# Altium project MB_SAUVC26.PrjPcb
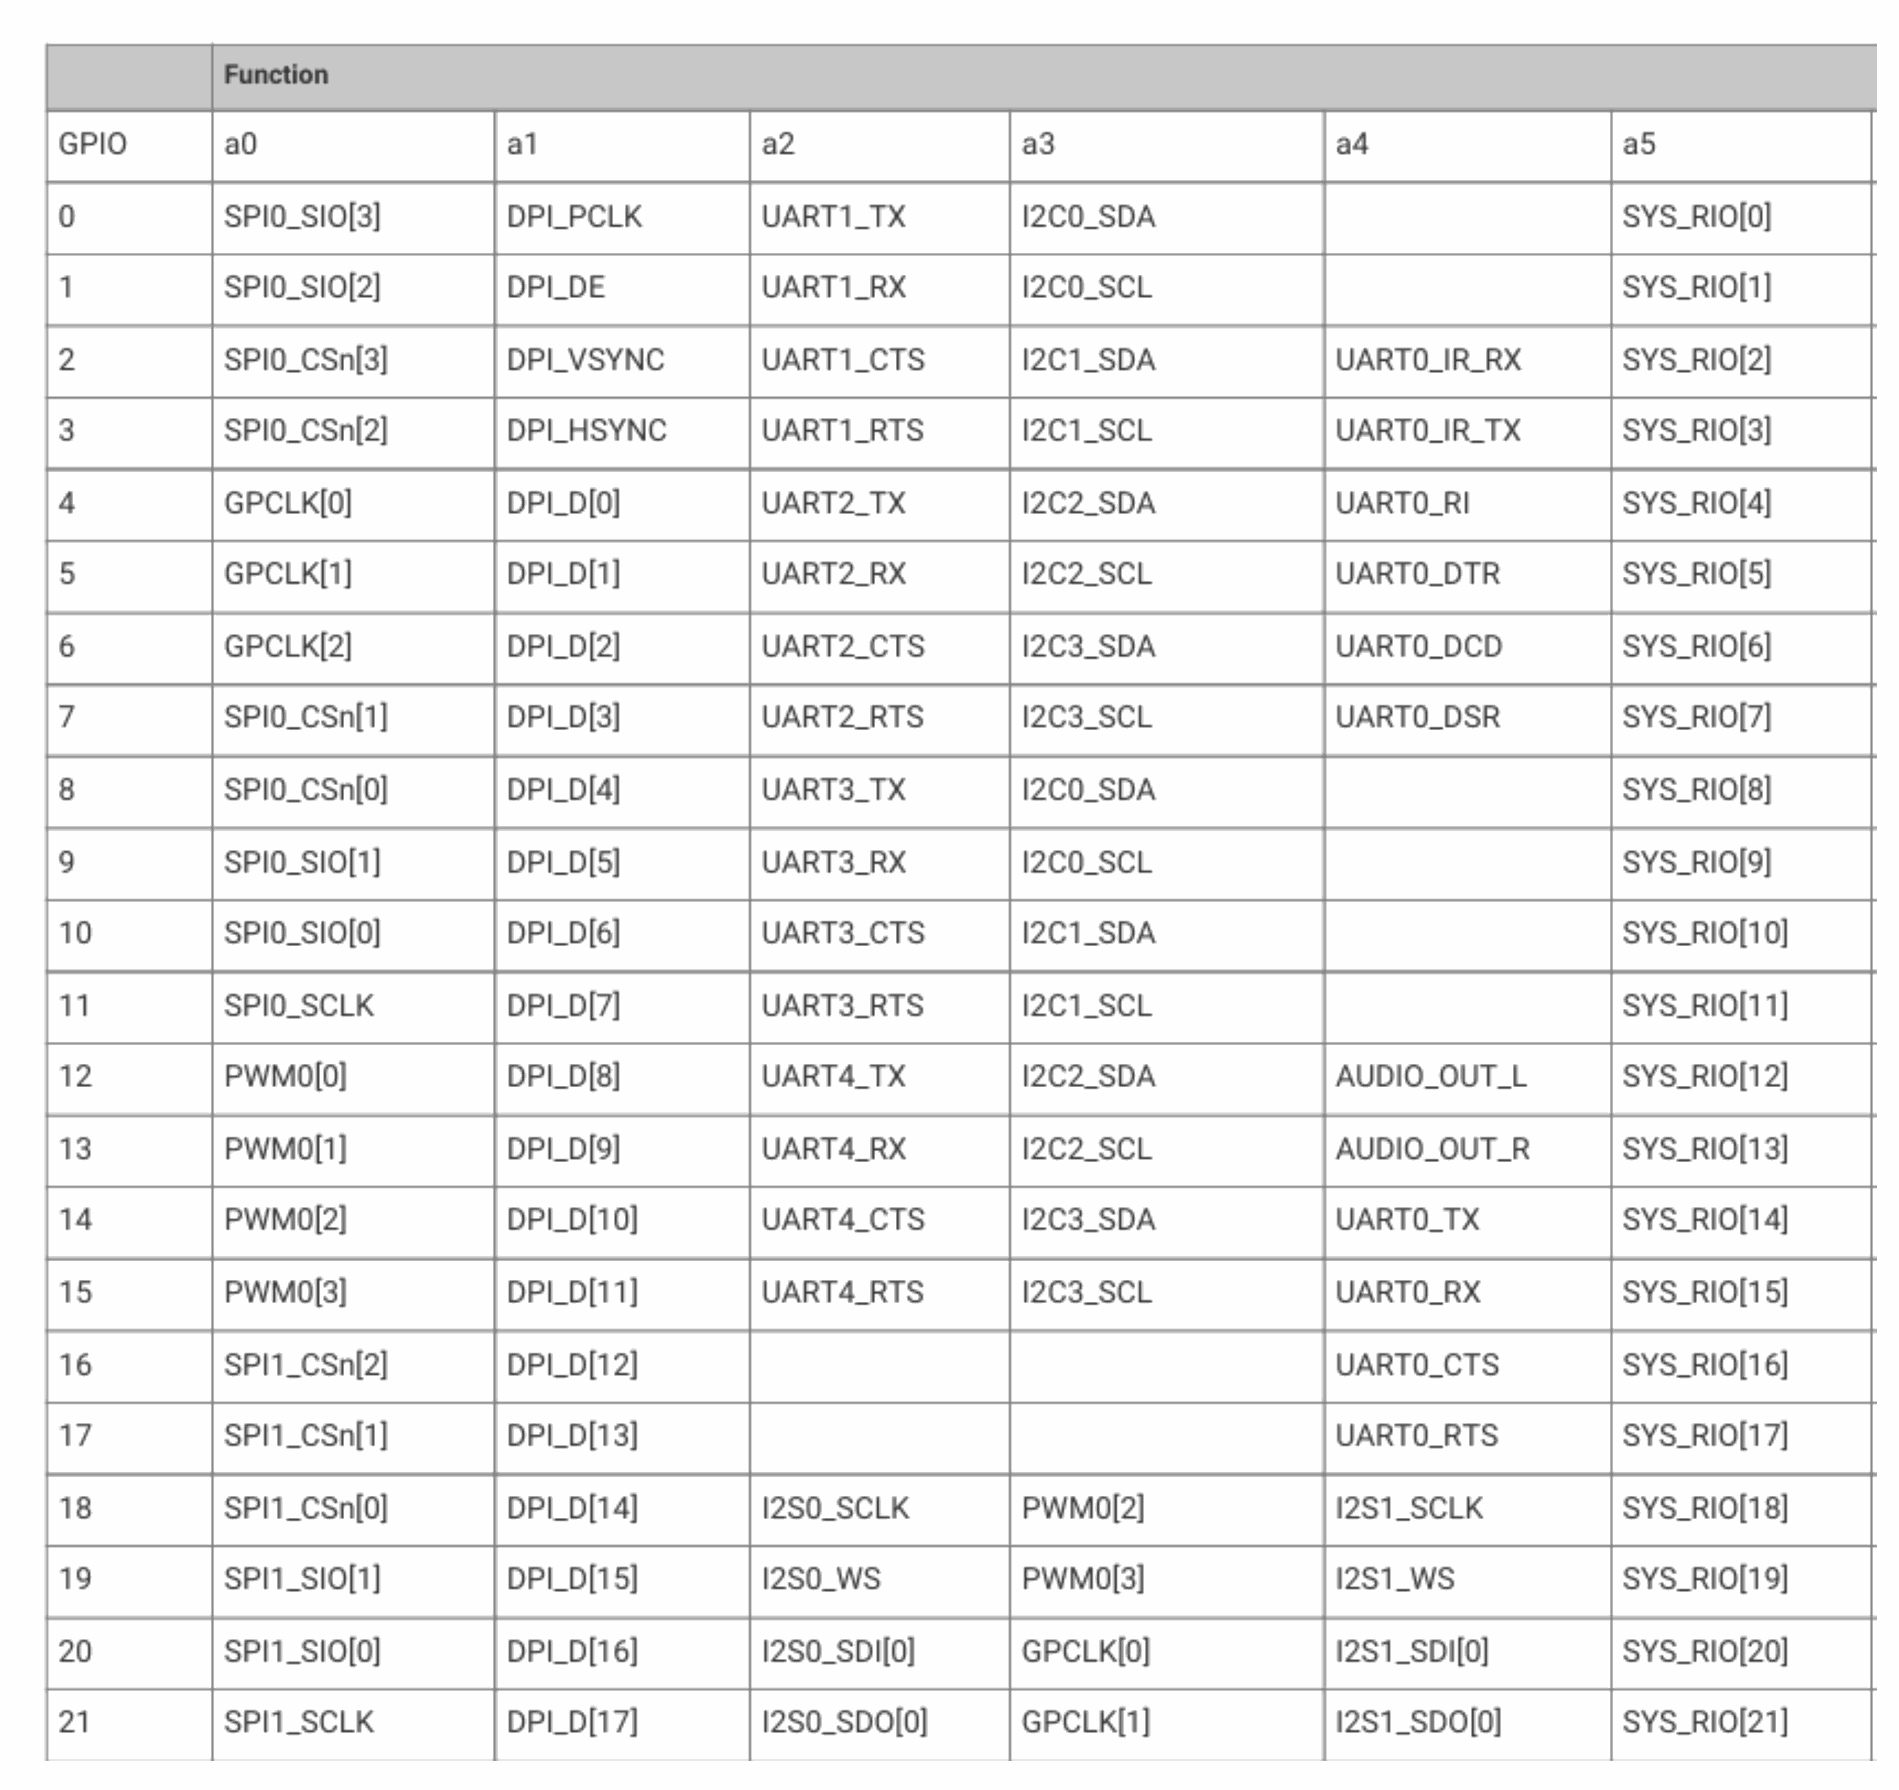
[diagram p0: Sheet1.SchDoc, left]
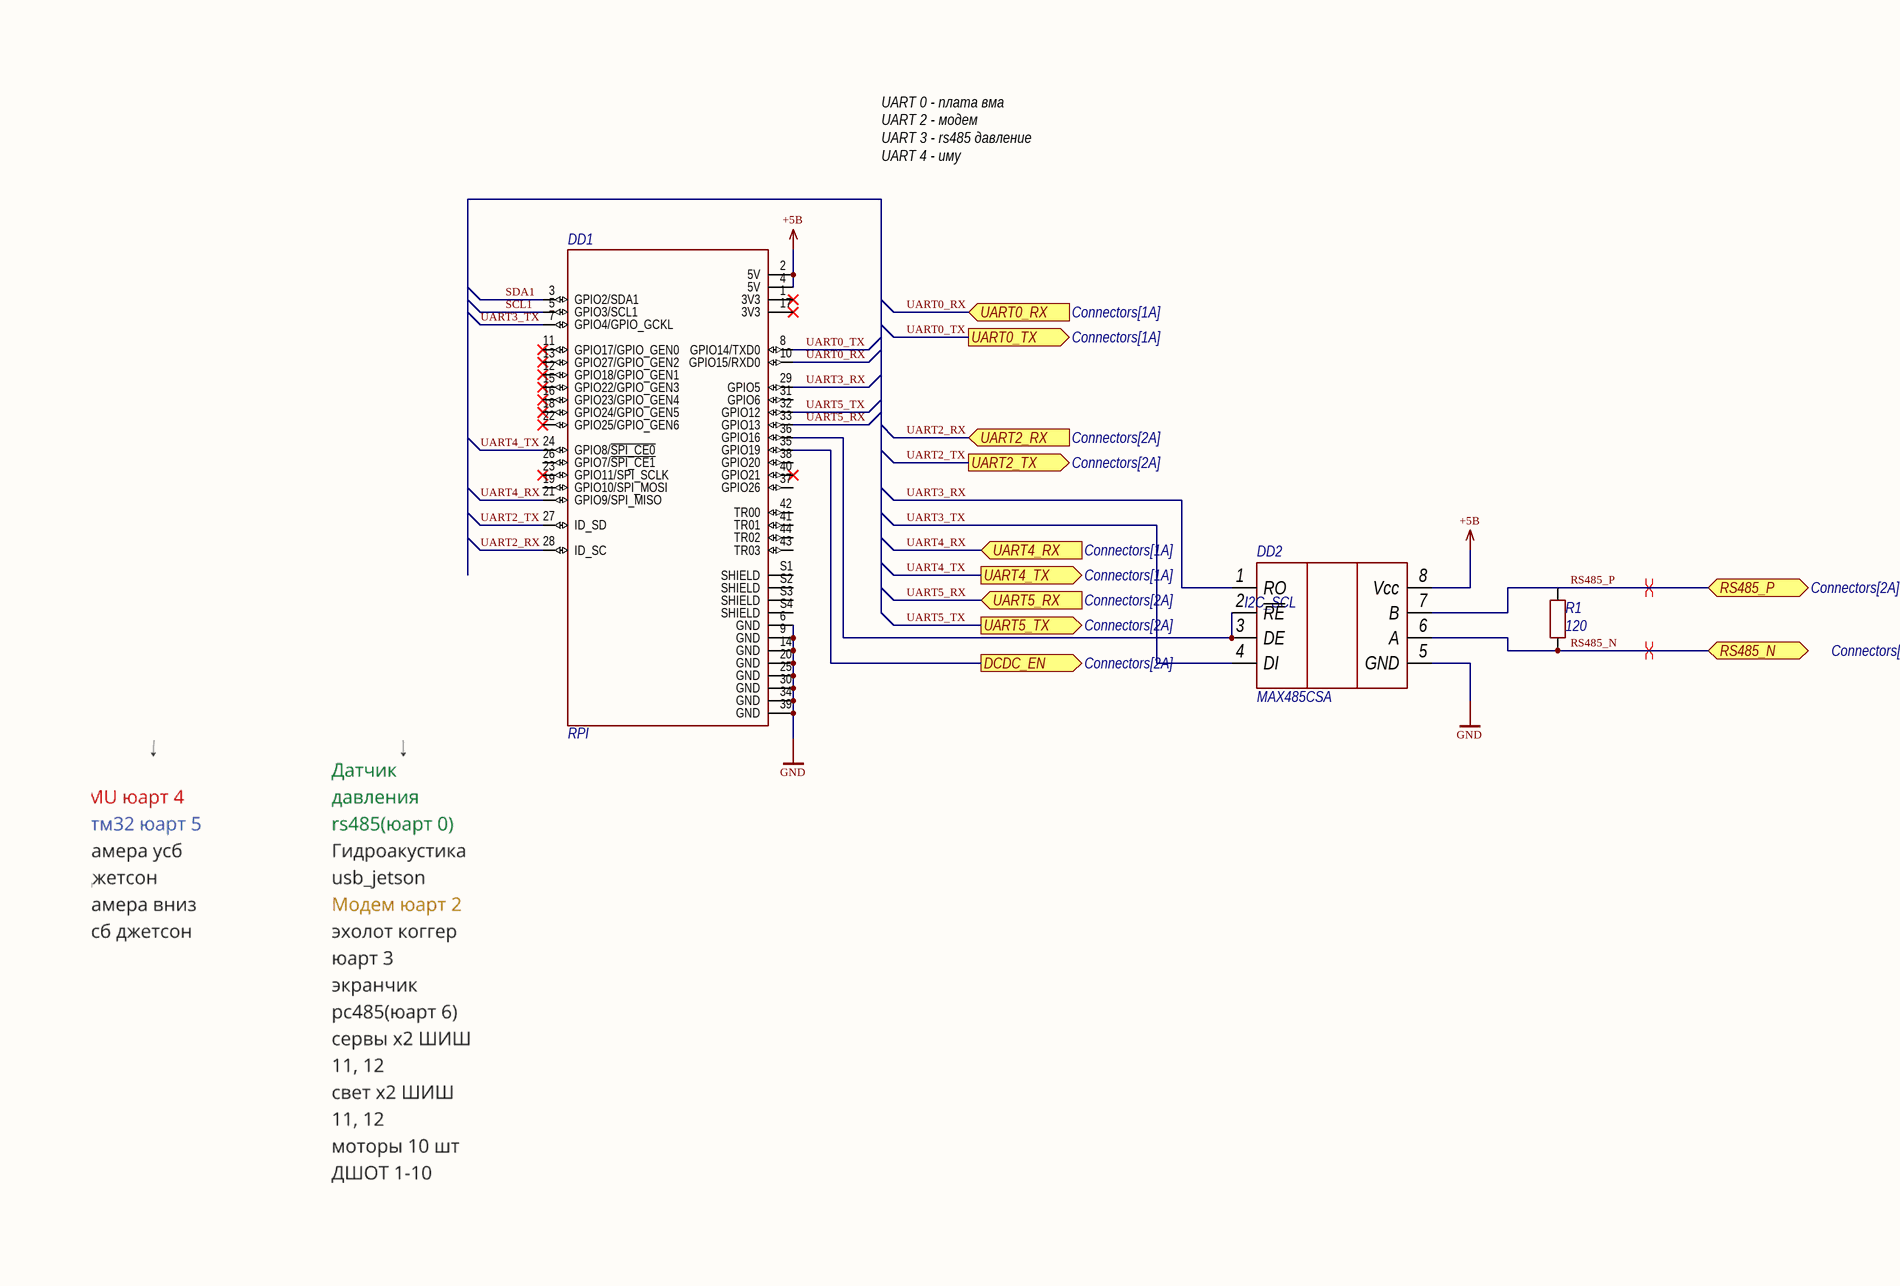
[diagram p1: Sheet1.SchDoc, right]
Version: 03; Title: Материнская плата аппарата НеоВельт; Release_Date: 29.07.2025; DrawnBy: Булатов и ко; Decimal_Number_Shematic: ГИДР.123456.011; Decimal_Number_PCB: ГИДР.123456.010
4 sheets, 72 parts. Net scope: global (net labels, ports and power ports of the same name join across sheets).
Board file: 4 layers.PcbDoc
Sheets:
  Sheet1.SchDoc
  DCDC_Jetson.SchDoc
  Connectors.SchDoc
  DCDC_RPI.SchDoc

## Sheet Sheet1.SchDoc: Материнская плата аппарата НеоВельт
size 420 x 297 mm; PageSetup: Record=PageOptions|CenterHorizontal=True|CenterVertical=True|PrintScale=0.94|XCorrection=1.00|YCorrection=1.00|PrintKind=1|BorderSize=5000000|LeftOffset=0|BottomOffset=0|Orientation=1|PaperLength=1000|PaperWidth=1000|Scale=100|PaperSource=7|PrintQuality=-4|MediaType=1|DitherType=10|PaperKind=A4|PrintScaleMode=1; Address1: Address1; Address2: Address2; Address3: Address3; Address4: Address4; DocumentNumber: 1; SheetNumber: 1; SheetTotal: 4

### Parts
DD1  RPI  [RPI]
DD2  MAX485CSA  [SOIC-8]
R1  value 120  [0603R]  (hidden comment: Resistor)

### Ports
DCDC_EN (out, see Connectors[2A]), RS485_N (bidir, see Connectors[2A]), RS485_P (bidir, see Connectors[2A]), UART0_RX (in, see Connectors[1A]), UART0_TX (out, see Connectors[1A]), UART2_RX (in, see Connectors[2A]), UART2_TX (out, see Connectors[2A]), UART4_RX (in, see Connectors[1A]), UART4_TX (out, see Connectors[1A]), UART5_RX (in, see Connectors[2A]), UART5_TX (out, see Connectors[2A])

### Nets
+5В: DD1.2(5V) DD1.4(5V) DD2.8(Vcc)
GND: DD1.6(GND) DD1.9(GND) DD1.14(GND) DD1.20(GND) DD1.25(GND) DD1.30(GND) DD1.34(GND) DD1.39(GND) DD2.5(GND)
DCDC_EN: DD1.35(GPIO19) ; port DCDC_EN
RS485_N: DD2.6(A) R1.1 ; port RS485_N
RS485_P: DD2.7(B) R1.2 ; port RS485_P
SCL1: DD1.5(GPIO3/SCL1)
SDA1: DD1.3(GPIO2/SDA1)
UART0_RX: DD1.10(GPIO15/RXD0) ; port UART0_RX
UART0_TX: DD1.8(GPIO14/TXD0) ; port UART0_TX
UART2_RX: DD1.28(ID_SC) ; port UART2_RX
UART2_TX: DD1.27(ID_SD) ; port UART2_TX
UART3_RX: DD1.29(GPIO5) DD2.1(RO)
UART3_TX: DD1.7(GPIO4/GPIO_GCKL) DD2.4(DI)
UART4_RX: DD1.21(GPIO9/SPI_MISO) ; port UART4_RX
UART4_TX: DD1.24(GPIO8/~{SPI_CE0}) ; port UART4_TX
UART5_RX: DD1.33(GPIO13) ; port UART5_RX
UART5_TX: DD1.32(GPIO12) ; port UART5_TX
NetDD1_36: DD1.36(GPIO16) DD2.2(~{RE}) DD2.3(DE)

Not connected (* = marked no-connect by the designer): DD1 1(3V3)* 11(GPIO17/GPIO_GEN0)* 12(GPIO18/GPIO_GEN1)* 13(GPIO27/GPIO_GEN2)* 15(GPIO22/GPIO_GEN3)* 16(GPIO23/GPIO_GEN4)* 17(3V3)* 18(GPIO24/GPIO_GEN5)* 19(GPIO10/SPI_MOSI) 22(GPIO25/GPIO_GEN6)* 23(GPIO11/SPI_SCLK)* 26(GPIO7/~{SPI_CE1}) 31(GPIO6) 37(GPIO26) 38(GPIO20) 40(GPIO21)* 41(TR01) 42(TR00) 43(TR03) 44(TR02) S1(SHIELD) S2(SHIELD) S3(SHIELD) S4(SHIELD)

### Layout directives
differential pair: RS485_N, RS485_P

### Notes on the sheet
- UART 0 - плата вма
  UART 2 - модем
  UART 3 - rs485 давление
  UART 4 - иму
- (near DD2) I2C_SCL
- Перв. примен.
- Справ. №
- Подп. и дата
- Инв. № дубл.
- Взам. инв. №
- Разраб.
- Изм.
- Лист
- № докум.
- Подп.
- Дата
- Лит.
- Масса
- Масштаб
- Пров.
- Т.контр.
- Схема электрическая принципиальная
- Листов
- Инв. № подл.
- Утв.
- Н.контр.
- Копировал
- Формат А3

### Library data of the parts
DD1 = RPI: Одноплатный компьютер Raspberry PI 4B; Part Number: RPI
DD2 = MAX485CSA: RS-485 приёмопередатчик; Part Number: MAX485CSA
R1 = Resistor_120_1_0603: Резистор номиналом 120 Ом и точностью 1%; Power: *; Part Number: Resistor_120_1_0603; Tolerance: 1%

## Sheet DCDC_Jetson.SchDoc: Материнская плата аппарата НеоВельт
size 420 x 297 mm; Address1: Address1; Address2: Address2; Address3: Address3; Address4: Address4; DocumentNumber: 4; SheetNumber: 2; SheetTotal: 4
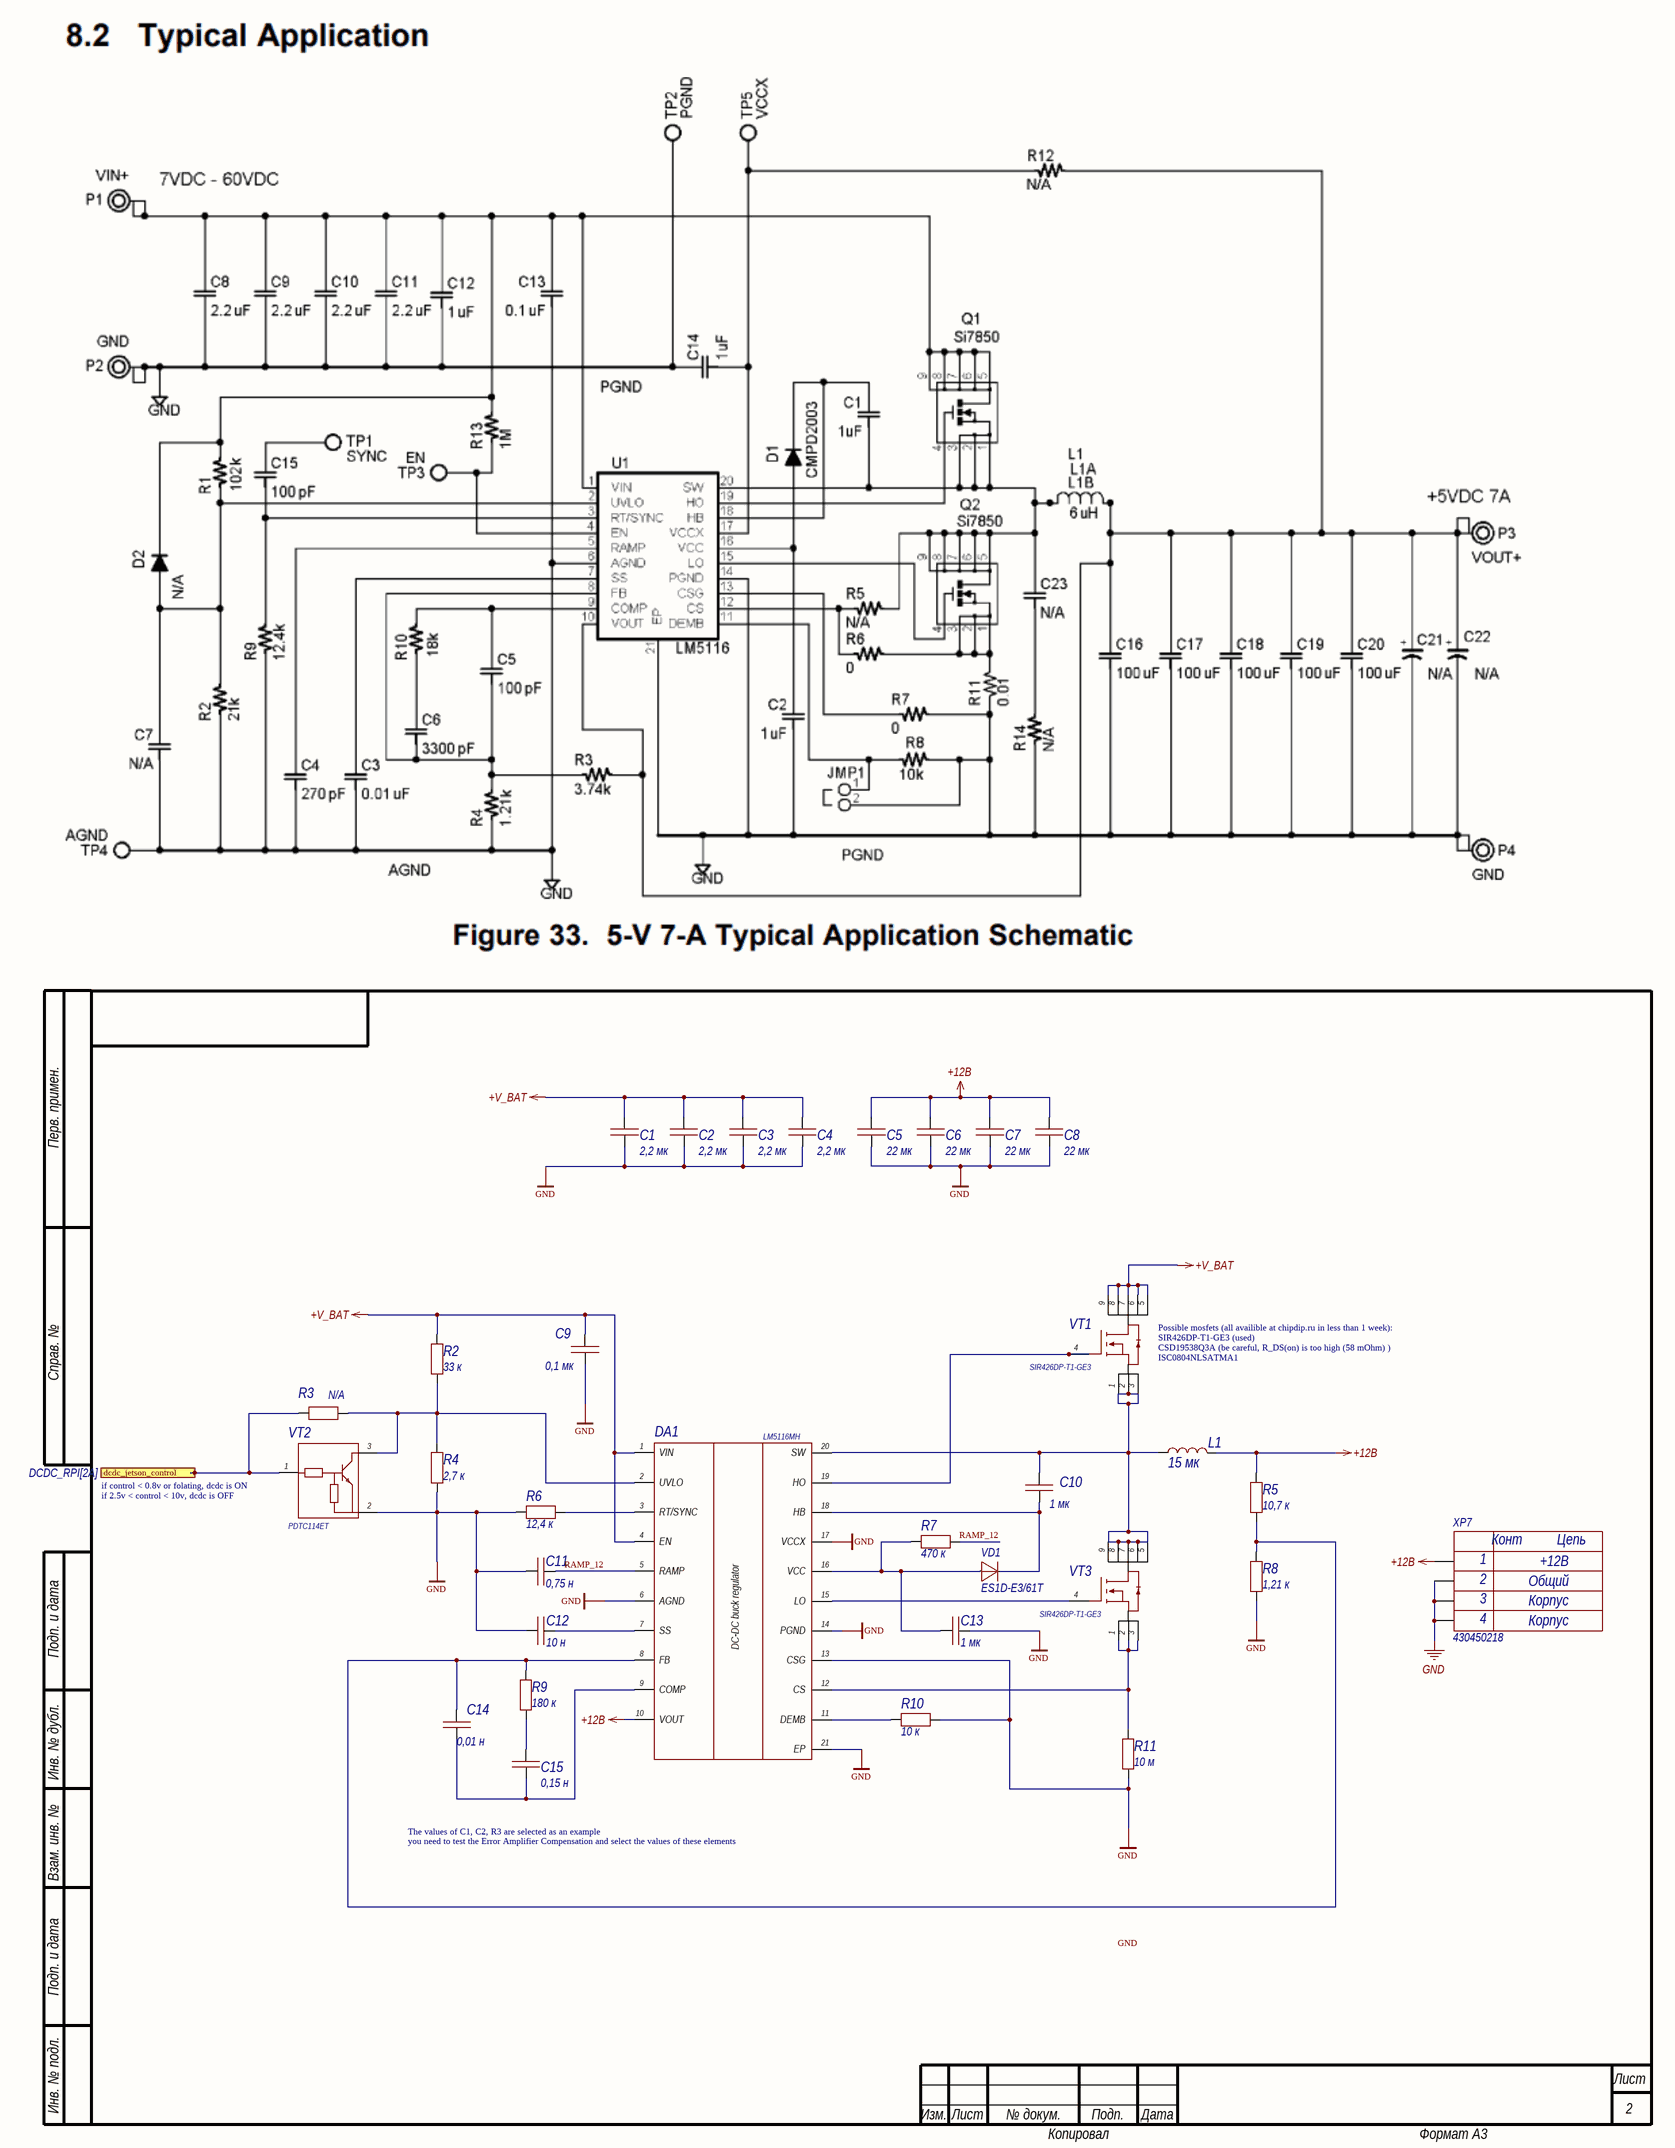
[diagram p2: DCDC_Jetson.SchDoc]

### Parts
C1  value 2,2 мк  [1206C]  (hidden comment: Capacitor)
C2  value 2,2 мк  [1206C]  (hidden comment: Capacitor)
C3  value 2,2 мк  [1206C]  (hidden comment: Capacitor)
C4  value 2,2 мк  [1206C]  (hidden comment: Capacitor)
C5  value 22 мк  [1210C]  (hidden comment: Capacitor)
C6  value 22 мк  [1210C]  (hidden comment: Capacitor)
C7  value 22 мк  [1210C]  (hidden comment: Capacitor)
C8  value 22 мк  [1210C]  (hidden comment: Capacitor)
C9  value 0,1 мк  [0603C]  (hidden comment: Capacitor)
C10  value 1 мк  [0603C]  (hidden comment: Capacitor)
C11  value 0,75 н  [0603C]  (hidden comment: Capacitor)
C12  value 10 н  [0603C]  (hidden comment: Capacitor)
C13  value 1 мк  [0603C]  (hidden comment: Capacitor)
C14  value 0,01 н  [0603C]  (hidden comment: Capacitor)
C15  value 0,15 н  [0603C]  (hidden comment: Capacitor)
DA1  LM5116MH  [HTSSOP-20]
L1  value 15 мк  [SPRH127]  (hidden comment: CDSPRH127-150M)
R2  value 33 к  [0603R]  (hidden comment: Resistor)
R3  Resistor  [0603R]  (value not drawn)
R4  value 2,7 к  [0603R]  (hidden comment: Resistor)
R5  value 10,7 к  [0603R]  (hidden comment: Resistor)
R6  value 12,4 к  [0603R]  (hidden comment: Resistor)
R7  value 470 к  [0603R]  (hidden comment: Resistor)
R8  value 1,21 к  [0603R]  (hidden comment: Resistor)
R9  value 180 к  [0603R]  (hidden comment: Resistor)
R10  value 10 к  [0603R]  (hidden comment: Resistor)
R11  value 10 м  [1210R]  (hidden comment: Resistor)
VD1  ES1D-E3/61T  [SMA]
VT1  SIR426DP-T1-GE3  [PowerPAK_SO-8]
VT2  PDTC114ET  [SOT23-3]
VT3  SIR426DP-T1-GE3  [PowerPAK_SO-8]
XP7  430450218  Value3: Корпус  Value2: Общий  Value1: +12В  [Molex_430450218]

### Ports
dcdc_jetson_control (in, see DCDC_RPI[2A])

### Nets
+12В: C5.2 C6.2 C7.2 C8.2 DA1.10(VOUT) L1.2 R5.2 XP7.1
+V_BAT: C1.2 C2.2 C3.2 C4.2 C9.2 DA1.1(VIN) DA1.4(EN) R2.2 VT1.5 VT1.6 VT1.7 VT1.8 VT1.9
GND: C1.1 C2.1 C3.1 C4.1 C5.1 C6.1 C7.1 C8.1 C9.1 C11.1 C12.1 C13.2 DA1.6(AGND) DA1.13(CSG) DA1.14(PGND) DA1.17(VCCX) DA1.21(EP) R4.1 R6.1 R8.1 R10.2 R11.1 VT2.2(E) XP7.0 XP7.2
RAMP_12: C11.2 DA1.5(RAMP) R7.2
NetC10_1: C10.1 DA1.18(HB) VD1.2
NetC10_2: C10.2 DA1.20(SW) L1.1 VT1.1 VT1.2 VT1.3 VT3.5 VT3.6 VT3.7 VT3.8 VT3.9
NetC12_2: C12.2 DA1.7(SS)
NetC13_1: C13.1 DA1.16(VCC) R7.1 VD1.1
NetC14_1: C14.1 C15.1 DA1.9(COMP)
NetC14_2: C14.2 DA1.8(FB) R5.1 R8.2 R9.2
NetC15_2: C15.2 R9.1
NetDA1_2: DA1.2(UVLO) R2.1 R3.2 R4.2 VT2.3(C)
NetDA1_3: DA1.3(RT/SYNC) R6.2
NetDA1_11: DA1.11(DEMB) R10.1
NetDA1_12: DA1.12(CS) R11.2 VT3.1 VT3.2 VT3.3
NetDA1_15: DA1.15(LO) VT3.4
NetDA1_19: DA1.19(HO) VT1.4
NetR3_1: R3.1 VT2.1(B) ; port dcdc_jetson_control

### Notes on the sheet
- (near VT1) Possible mosfets (all availible at chipdip.ru in less than 1 week):
- (near VT1) CSD19538Q3A (be careful, R_DS(on) is too high (58 mOhm) )
- (near VT1) SIR426DP-T1-GE3 (used)
- (near VT1) ISC0804NLSATMA1
- (near VT2) if 2.5v < control < 10v, dcdc is OFF
- (near VT2) if control < 0.8v or folating, dcdc is ON
- The values of C1, C2, R3 are selected as an example
- you need to test the Error Amplifier Compensation and select the values of these elements
- Labels drawn without touching a wire or pin: GND
- Перв. примен.
- Справ. №
- Подп. и дата
- Инв. № дубл.
- Взам. инв. №
- Инв. № подл.
- Изм.
- Лист
- № докум.
- Подп.
- Дата
- Копировал
- Формат А3
- (in symbol LM5116MH) DC-DC buck regulator
- (in symbol Molex_430450218) Конт; Цепь; 3; 4

### Library data of the parts
C1-C4 = Capacitor_2,2u_10_50V_X7R_1206C: Конденсатор; Library Path2: Schematic\Capacitor.SchLib; Tolerance: 0,1; Voltage (V): 50; Dielectric: X7R; Capacity (nF): 2200; Part Number: Capacitor_2,2u_10_50V_X7R_1206C
C5-C8 = Capacitor_22u_10_25V_X7R_1210C: Конденсатор; Library Path2: Schematic\Capacitor.SchLib; Tolerance: 0,1; Voltage (V): 25; Dielectric: X7R; Capacity (nF): 22000; Part Number: Capacitor_22u_10_25V_X7R_1210C
C9 = Capacitor_0,1u_10_50V_X7R_0603C: Конденсатор; Library Path2: Schematic\Capacitor.SchLib; Tolerance: 0,1; Voltage (V): 50; Dielectric: X7R; Capacity (nF): 100; Part Number: Capacitor_0,1u_10_50V_X7R_0603C
C10 C13 = Capacitor_1u_10_50V_X7R_0603C: Конденсатор; Library Path2: Schematic\Capacitor.SchLib; Tolerance: 0,1; Voltage (V): 50; Dielectric: X7R; Capacity (nF): 1000; Part Number: Capacitor_1u_10_50V_X7R_0603C
C11 = Capacitor_0,75n_10_50V_X7R_0603C: Конденсатор; Library Path2: Schematic\Capacitor.SchLib; Tolerance: 0,1; Voltage (V): 50; Dielectric: X7R; Capacity (nF): 0,75; Part Number: Capacitor_0,75n_10_50V_X7R_0603C
C12 = Capacitor_10n_10_50V_X7R_0603C: Конденсатор; Library Path2: Schematic\Capacitor.SchLib; Tolerance: 0,1; Voltage (V): 50; Dielectric: X7R; Capacity (nF): 10; Part Number: Capacitor_10n_10_50V_X7R_0603C
C14 = Capacitor_0,01n_10_50V_X7R_0603C: Конденсатор; Library Path2: Schematic\Capacitor.SchLib; Tolerance: 0,1; Voltage (V): 50; Dielectric: X7R; Capacity (nF): 0,01; Part Number: Capacitor_0,01n_10_50V_X7R_0603C
C15 = Capacitor_0,15n_10_50V_X7R_0603C: Конденсатор; Library Path2: Schematic\Capacitor.SchLib; Tolerance: 0,1; Voltage (V): 50; Dielectric: X7R; Capacity (nF): 0,15; Part Number: Capacitor_0,15n_10_50V_X7R_0603C
DA1 = LM5116MH: dc-dc понижающий adj 6-100v; Manufacturer_Part_Number: LM5116MH/NOPB; Part Number: LM5116MH
L1 = CDSPRH127-150M: Индуктивность на 15 мкГн, номинальный ток 8,4 А; Inductance (μH): 15; Current (A): 8,4; Part Number: CDSPRH127-150M
R2 = Resistor_33k_1_0603: Резистор номиналом 33 кОм и точностью 1%; Power: *; Part Number: Resistor_33k_1_0603; Tolerance: 1%
R3 = res_0603_N/A: посадочное место 0603 под перемычку; Tolerance: 1%; Power: *; Value: N/A; Part Number: res_0603_N/A
R4 = Resistor_2.7k_1_0603: Резистор номиналом 2,7 кОм и точностью 1%; Power: *; Part Number: Resistor_2.7k_1_0603; Tolerance: 1%
R5 = Resistor_10.7k_1_0603: Резистор номиналом 10,7 кОм и точностью 1%; Power: *; Part Number: Resistor_10.7k_1_0603; Tolerance: 1%
R6 = Resistor_12.4k_1_0603: Резистор номиналом 12,4 кОм и точностью 1%; Power: *; Part Number: Resistor_12.4k_1_0603; Tolerance: 1%
R7 = Resistor_470k_1_0603: Резистор номиналом 470 кОм и точностью 1%; Power: *; Part Number: Resistor_470k_1_0603; Tolerance: 1%
R8 = Resistor_1.21k_1_0603: Резистор номиналом 1,21 кОм и точностью 1%; Power: *; Part Number: Resistor_1.21k_1_0603; Tolerance: 1%
R9 = Resistor_180k_1_0603: Резистор номиналом 180 кОм и точностью 1%; Power: *; Part Number: Resistor_180k_1_0603; Tolerance: 1%
R10 = Resistor_10k_1_0603: Резистор номиналом 10 кОм и точностью 1%; Power: *; Part Number: Resistor_10k_1_0603; Tolerance: 1%
R11 = RL1210FR-070R01L: Резистор номиналом 10 мОм, точностью 1%, 0.5Вт; Power: *; Part Number: RL1210FR-070R01L; Tolerance: 1%
VD1 = ES1D-E3/61T: Диод 1A 200V; Repetitive peak reverse voltage (Vrrm): 200; Current (A): 1; Part Number: ES1D-E3/61T
VT1 VT3 = SIR426DP-T1-GE3: Транзистор полевой MOSFET N-канальный 40В 41.7Вт; Part Number: SIR426DP-T1-GE3; Напряжение С-И/К-Э: 40 В
VT2 = PDTC114ET: цифровой npn 50в 100мА; Ток макс#: 0, 1 А; Part Number: PDTC114ET; Напряжение С-И/К-Э: 50 В
XP7 = Molex_430450218: Разъем типа провод-плата, 3 мм, 2 контакт(-ов), Штыревой Разъем, Серия Micro-Fit для поверхностного монтажа; System: Connector; Value4: Корпус; Part Number: Molex_430450218

## Sheet Connectors.SchDoc: Материнская плата аппарата НеоВельт
size 594 x 420 mm; PageSetup: Record=PageOptions|CenterHorizontal=True|CenterVertical=True|PrintScale=0.94|XCorrection=1.00|YCorrection=1.00|PrintKind=1|BorderSize=5000000|LeftOffset=0|BottomOffset=0|Orientation=1|PaperLength=1000|PaperWidth=1000|Scale=100|PaperSource=7|PrintQuality=-4|MediaType=1|DitherType=10|PaperKind=A4|PrintScaleMode=1; Address1: Address1; Address2: Address2; Address3: Address3; Address4: Address4; DocumentNumber: 5; SheetNumber: 3; SheetTotal: 4
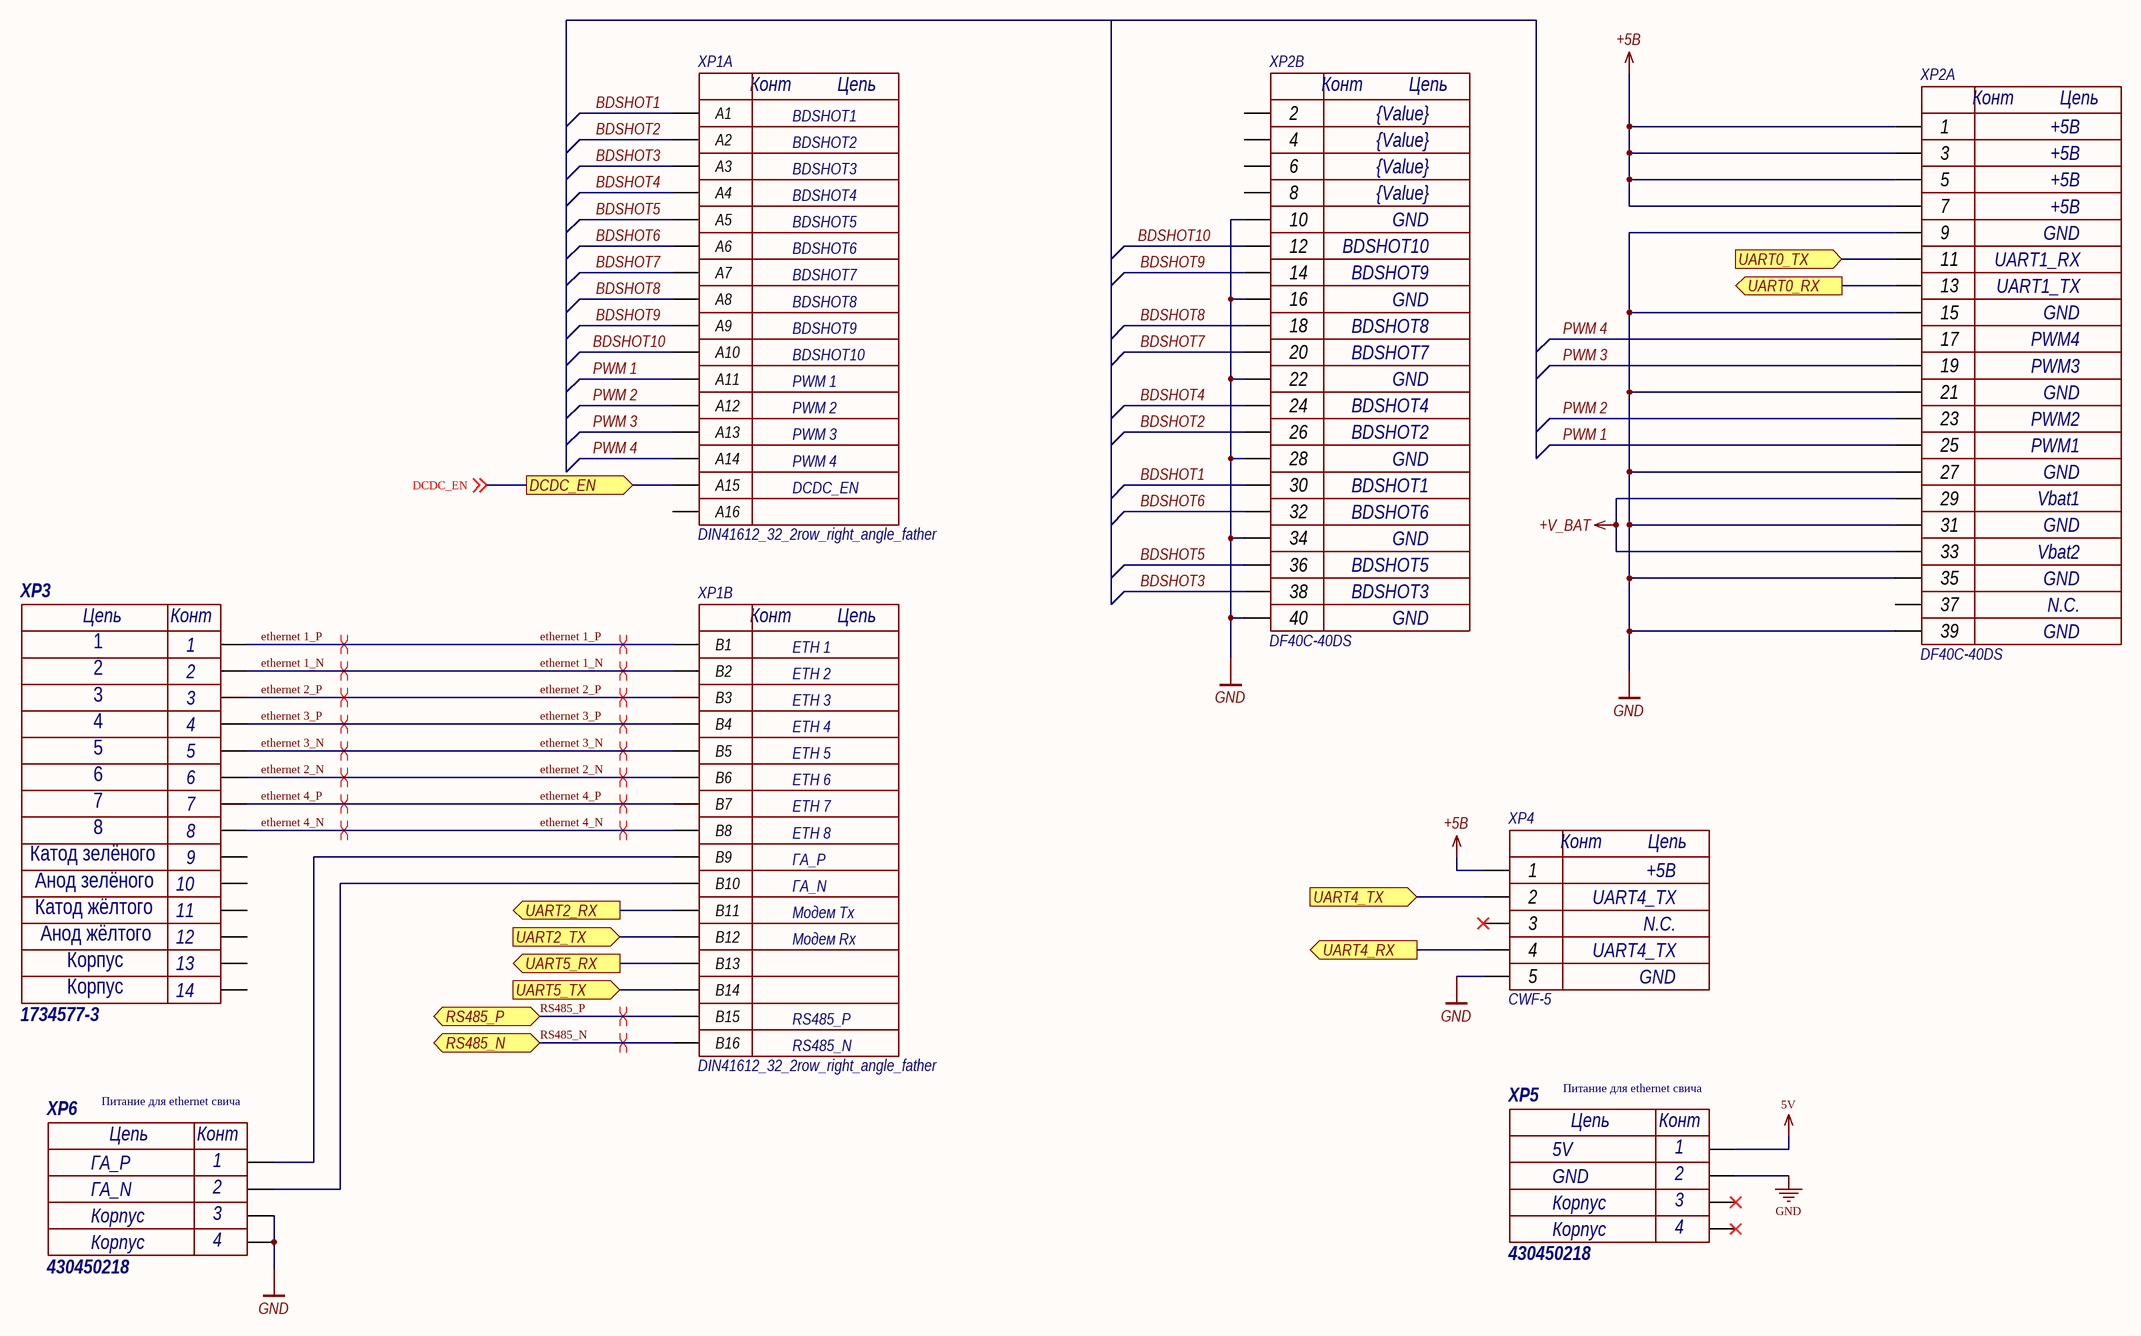
[diagram p3: Connectors.SchDoc]

### Parts
XP1  DIN41612_32_2row_right_angle_father  [DIN41612_32_2row_right_angle_father]  (parts A,B of 2)
XP2  DF40C-40DS  Value17: Vbat2  Value20: GND  Value19: N.C.  Value15: Vbat1  Value13: PWM1  Value12: PWM2  Value10: PWM3  Value9: PWM4  Value7: UART1_TX  Value6: UART1_RX  Value4: +5В  [DF40C-40DS]  (parts A,B of 2)
XP3  1734577-3  [1-1734577-3-rj45-8p8c]
XP4  CWF-5  Value1: +5В  Value2: UART4_TX  Value3: N.C.  Value5: GND  [CWF-5]
XP5  430450218  Value3: Корпус  Value2: GND  Value1: 5V  Parameter 1: Питание для ethernet свича  [Molex_430450218]
XP6  430450218  Value3: Корпус  Value2: ГА_N  Value1: ГА_P  Parameter 1: Питание для ethernet свича  [Molex_430450218]

### Ports
DCDC_EN (out), RS485_N (bidir), RS485_P (bidir), UART0_RX (out), UART0_TX (in), UART2_RX (out), UART2_TX (in), UART4_RX (out), UART4_TX (in), UART5_RX (out), UART5_TX (in)

### Nets
5V: XP5.1
+5В: XP2.1 XP2.3 XP2.5 XP2.7 XP4.1
+V_BAT: XP2.29 XP2.33
GND: XP2.9 XP2.10 XP2.15 XP2.16 XP2.21 XP2.22 XP2.27 XP2.28 XP2.31 XP2.34 XP2.35 XP2.39 XP2.40 XP4.5 XP5.2 XP6.0
BDSHOT1: XP1.A1 XP2.30
BDSHOT2: XP1.A2 XP2.26
BDSHOT3: XP1.A3 XP2.38
BDSHOT4: XP1.A4 XP2.24
BDSHOT5: XP1.A5 XP2.36
BDSHOT6: XP1.A6 XP2.32
BDSHOT7: XP1.A7 XP2.20
BDSHOT8: XP1.A8 XP2.18
BDSHOT9: XP1.A9 XP2.14
BDSHOT10: XP1.A10 XP2.12
DCDC_EN: XP1.A15 ; off-sheet DCDC_EN, port DCDC_EN
ethernet 1_N: XP1.B2 XP3.2
ethernet 1_P: XP1.B1 XP3.1
ethernet 2_N: XP1.B6 XP3.6
ethernet 2_P: XP1.B3 XP3.3
ethernet 3_N: XP1.B5 XP3.5
ethernet 3_P: XP1.B4 XP3.4
ethernet 4_N: XP1.B8 XP3.8
ethernet 4_P: XP1.B7 XP3.7
PWM 1: XP1.A11 XP2.25
PWM 2: XP1.A12 XP2.23
PWM 3: XP1.A13 XP2.19
PWM 4: XP1.A14 XP2.17
RS485_N: XP1.B16 ; port RS485_N
RS485_P: XP1.B15 ; port RS485_P
UART0_RX: XP2.13 ; port UART0_RX
UART0_TX: XP2.11 ; port UART0_TX
UART2_RX: XP1.B11 ; port UART2_RX
UART2_TX: XP1.B12 ; port UART2_TX
UART4_RX: XP4.4 ; port UART4_RX
UART4_TX: XP4.2 ; port UART4_TX
UART5_RX: XP1.B13 ; port UART5_RX
UART5_TX: XP1.B14 ; port UART5_TX
NetXP1_B9: XP1.B9 XP6.1
NetXP1_B10: XP1.B10 XP6.2

Not connected (* = marked no-connect by the designer): XP1 A16; XP2 2 4 6 8 37; XP3 9 10 11 12 MH1 MH2; XP4 3*; XP5 0*

### Layout directives
differential pair: ethernet 1_N, ethernet 1_P, ethernet 2_N, ethernet 2_P, ethernet 3_N, ethernet 3_P, ethernet 4_N, ethernet 4_P, RS485_N, RS485_P

### Notes on the sheet
- BDSHOT1
- BDSHOT2
- BDSHOT3
- BDSHOT4
- BDSHOT5
- BDSHOT6
- BDSHOT7
- BDSHOT8
- BDSHOT9
- BDSHOT10
- PWM 1
- PWM 2
- PWM 3
- PWM 4
- DCDC_EN
- ETH 1
- ETH 2
- ETH 3
- ETH 4
- ETH 5
- ETH 6
- ETH 7
- ETH 8
- ГА_P
- ГА_N
- Модем Tx
- Модем Rx
- RS485_P
- RS485_N
- Перв. примен.
- Справ. №
- Подп. и дата
- Инв. № дубл.
- Взам. инв. №
- Инв. № подл.
- Изм.
- Лист
- № докум.
- Подп.
- Дата
- Копировал
- Формат А2
- (in symbol 1-1734577-3-rj45-8p8c) Цепь; Конт; Катод зелёного; Анод зелёного; Катод жёлтого; Анод жёлтого; Корпус; 13; 14
- (in symbol CWF-5) Конт; Цепь
- (in symbol DIN41612_32_2row_right_angle_father, part A) Конт; Цепь
- (in symbol DIN41612_32_2row_right_angle_father, part B) Конт; Цепь

### Library data of the parts
XP1 = DIN41612_32_2row_right_angle_father: DIN41612R (DS1118-32M0R23), Разъем (вилка) тип B 32pin (2х16), шаг 2.54мм двухрядный угловой (ряд АВ); Part Number: DIN41612_32_2row_right_angle_father
XP2 = DF40C-40DS: Разъем плата-плата 40 пинов, папа, шаг 0.4мм; System: Connector; Value18: GND; Value16: GND; Value14: GND; Value11: GND; Value8: GND; Value5: GND; Value3: +5В; Value2: +5В; Value1: +5В; Part Number: DF40C-40DS
XP3 = 1-1734577-3-rj45-8p8c: Модульный разъем, Cat3, RJ45, Гнездо, 8 контакт(-ов), 8 вывод(-ов), 1 порт(-ов); Part Number: 1-1734577-3-rj45-8p8c
XP4 = CWF-5: 5-пиновый разъем с ключом; System: Connector; Value4: UART4_TX; Part Number: CWF-5
XP5 XP6 = Molex_430450218: Разъем типа провод-плата, 3 мм, 2 контакт(-ов), Штыревой Разъем, Серия Micro-Fit для поверхностного монтажа; Value4: Корпус; Part Number: Molex_430450218

## Sheet DCDC_RPI.SchDoc: Материнская плата аппарата НеоВельт
size 420 x 297 mm; SheetNumber: 4; SheetTotal: 4
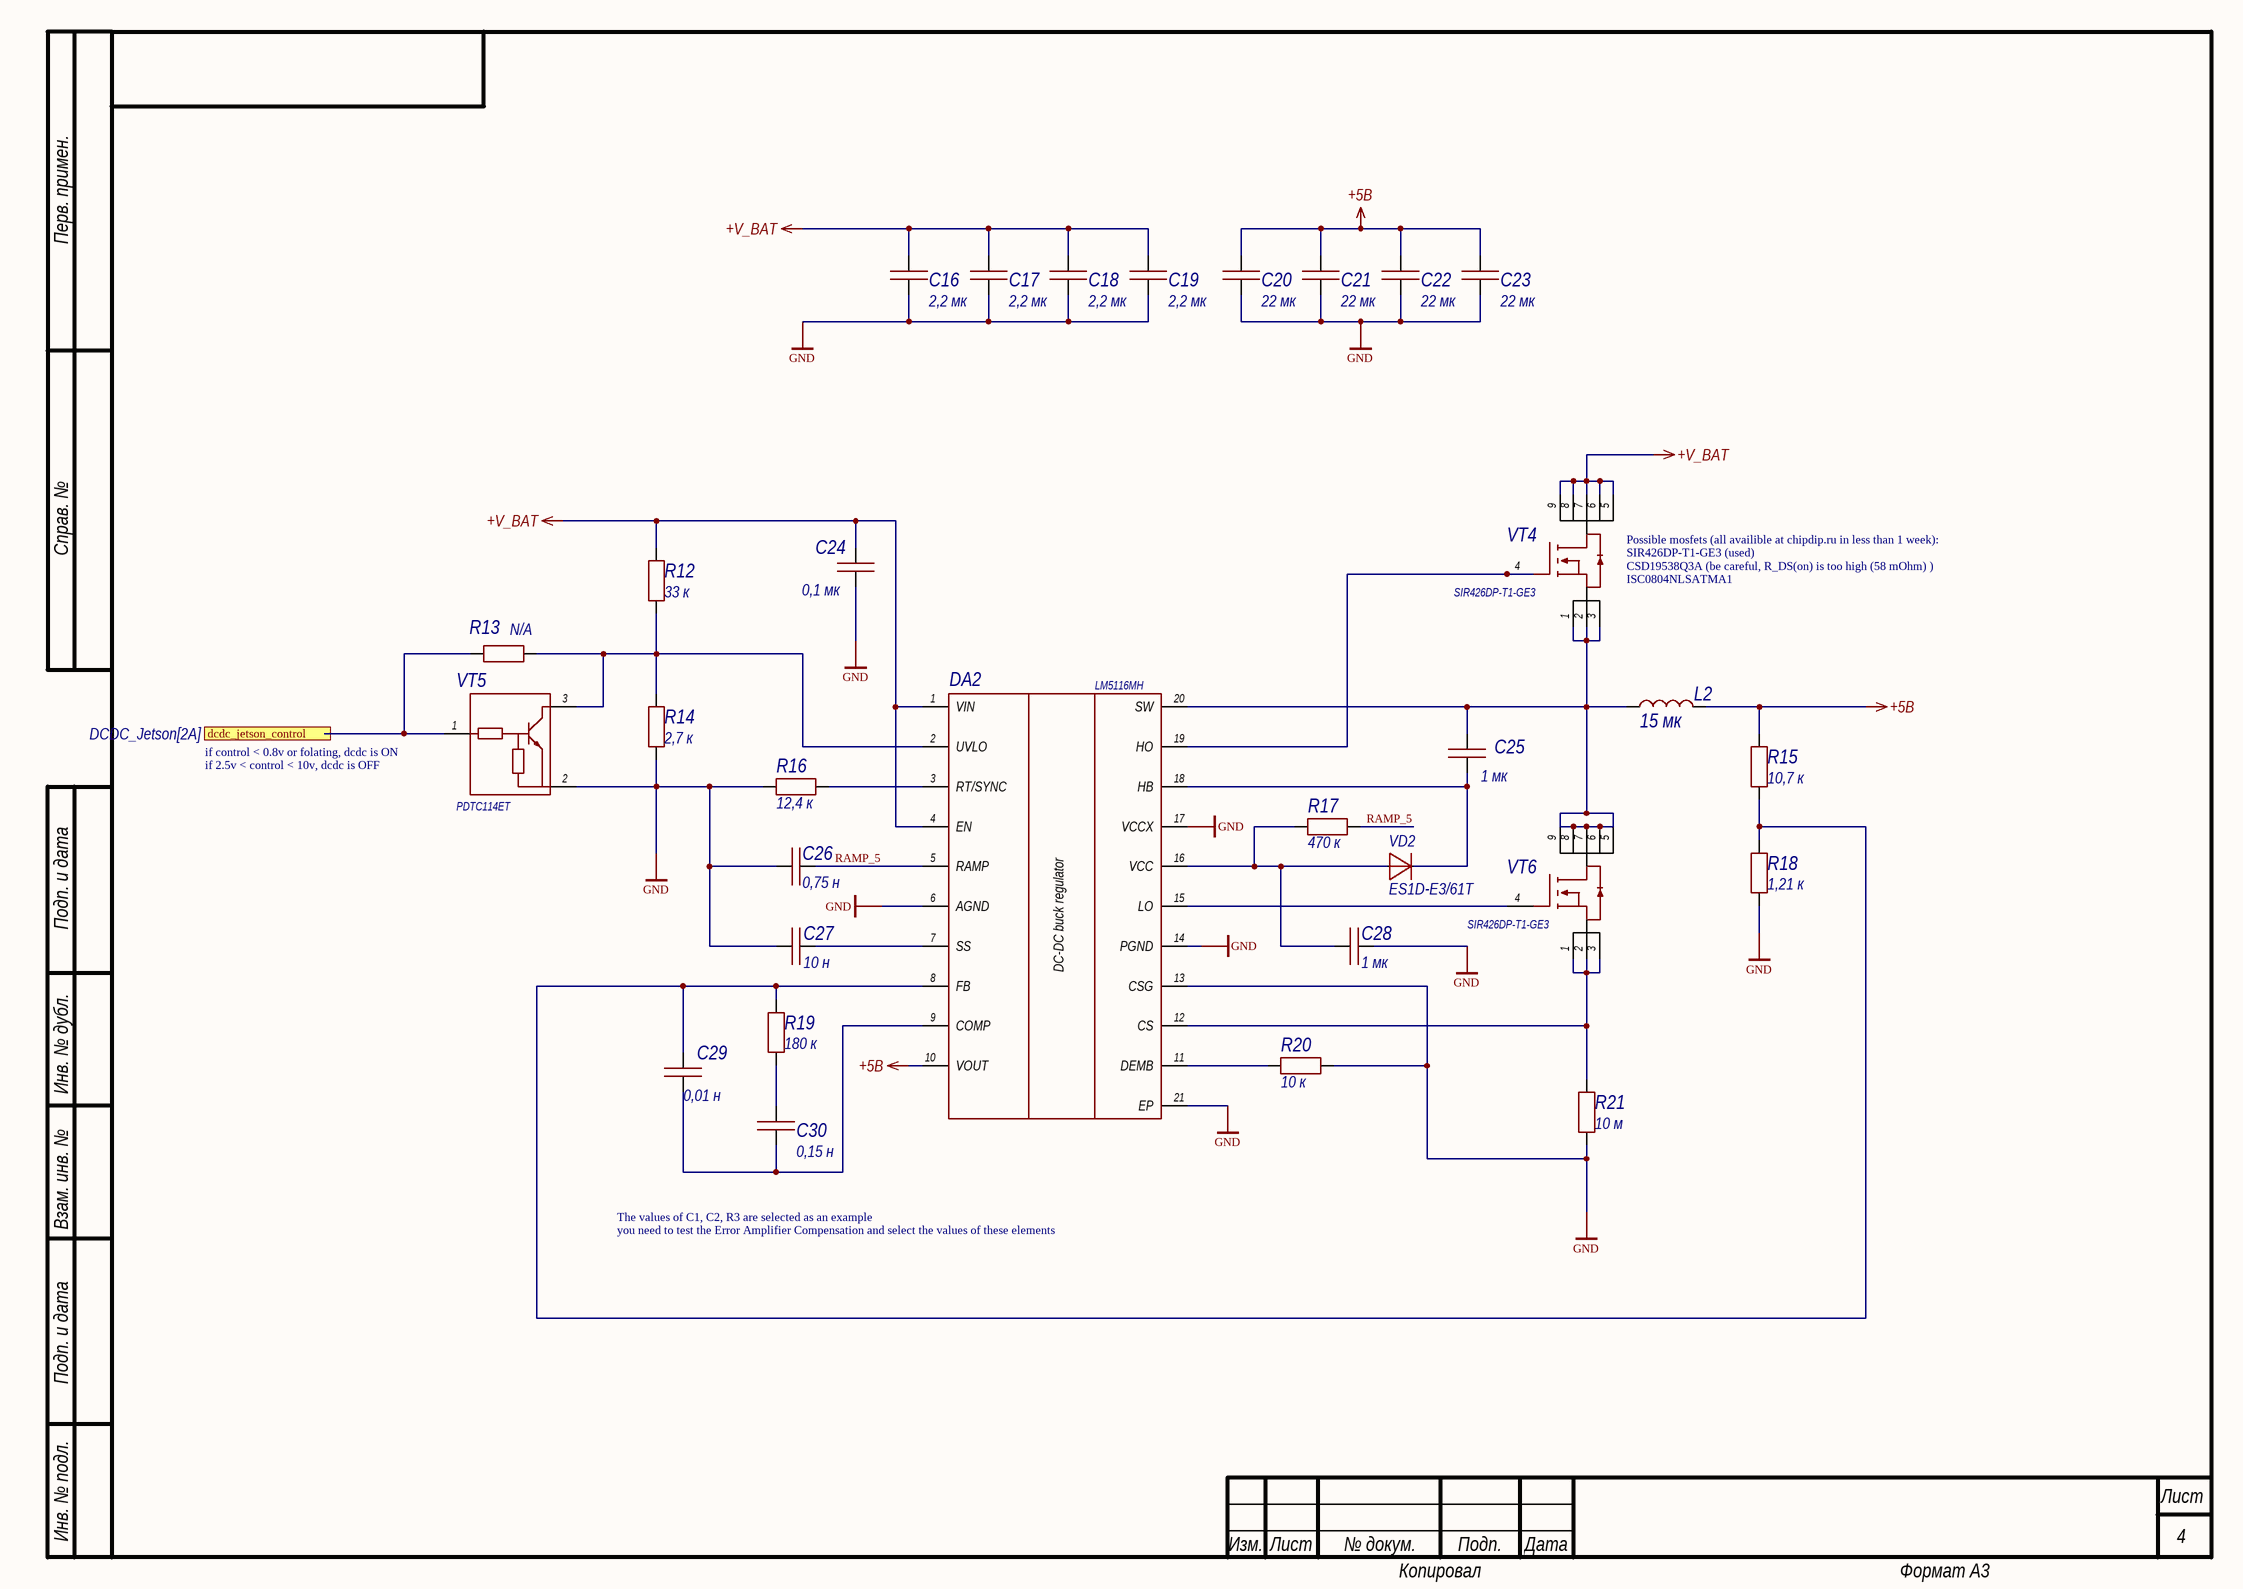
[diagram p4: DCDC_RPI.SchDoc]

### Parts
C16  value 2,2 мк  [1206C]  (hidden comment: Capacitor)
C17  value 2,2 мк  [1206C]  (hidden comment: Capacitor)
C18  value 2,2 мк  [1206C]  (hidden comment: Capacitor)
C19  value 2,2 мк  [1206C]  (hidden comment: Capacitor)
C20  value 22 мк  [1210C]  (hidden comment: Capacitor)
C21  value 22 мк  [1210C]  (hidden comment: Capacitor)
C22  value 22 мк  [1210C]  (hidden comment: Capacitor)
C23  value 22 мк  [1210C]  (hidden comment: Capacitor)
C24  value 0,1 мк  [0603C]  (hidden comment: Capacitor)
C25  value 1 мк  [0603C]  (hidden comment: Capacitor)
C26  value 0,75 н  [0603C]  (hidden comment: Capacitor)
C27  value 10 н  [0603C]  (hidden comment: Capacitor)
C28  value 1 мк  [0603C]  (hidden comment: Capacitor)
C29  value 0,01 н  [0603C]  (hidden comment: Capacitor)
C30  value 0,15 н  [0603C]  (hidden comment: Capacitor)
DA2  LM5116MH  [HTSSOP-20]
L2  value 15 мк  [SPRH127]  (hidden comment: CDSPRH127-150M)
R12  value 33 к  [0603R]  (hidden comment: Resistor)
R13  Resistor  [0603R]  (value not drawn)
R14  value 2,7 к  [0603R]  (hidden comment: Resistor)
R15  value 10,7 к  [0603R]  (hidden comment: Resistor)
R16  value 12,4 к  [0603R]  (hidden comment: Resistor)
R17  value 470 к  [0603R]  (hidden comment: Resistor)
R18  value 1,21 к  [0603R]  (hidden comment: Resistor)
R19  value 180 к  [0603R]  (hidden comment: Resistor)
R20  value 10 к  [0603R]  (hidden comment: Resistor)
R21  value 10 м  [1210R]  (hidden comment: Resistor)
VD2  ES1D-E3/61T  [SMA]
VT4  SIR426DP-T1-GE3  [PowerPAK_SO-8]
VT5  PDTC114ET  [SOT23-3]
VT6  SIR426DP-T1-GE3  [PowerPAK_SO-8]

### Ports
dcdc_jetson_control (in, see DCDC_Jetson[2A])

### Nets
+5В: C20.2 C21.2 C22.2 C23.2 DA2.10(VOUT) L2.2 R15.2
+V_BAT: C16.2 C17.2 C18.2 C19.2 C24.2 DA2.1(VIN) DA2.4(EN) R12.2 VT4.5 VT4.6 VT4.7 VT4.8 VT4.9
GND: C16.1 C17.1 C18.1 C19.1 C20.1 C21.1 C22.1 C23.1 C24.1 C26.1 C27.1 C28.2 DA2.6(AGND) DA2.13(CSG) DA2.14(PGND) DA2.17(VCCX) DA2.21(EP) R14.1 R16.1 R18.1 R20.2 R21.1 VT5.2(E)
RAMP_5: C26.2 DA2.5(RAMP) R17.2
NetC25_1: C25.1 DA2.18(HB) VD2.2
NetC25_2: C25.2 DA2.20(SW) L2.1 VT4.1 VT4.2 VT4.3 VT6.5 VT6.6 VT6.7 VT6.8 VT6.9
NetC27_2: C27.2 DA2.7(SS)
NetC28_1: C28.1 DA2.16(VCC) R17.1 VD2.1
NetC29_1: C29.1 C30.1 DA2.9(COMP)
NetC29_2: C29.2 DA2.8(FB) R15.1 R18.2 R19.2
NetC30_2: C30.2 R19.1
NetDA2_2: DA2.2(UVLO) R12.1 R13.2 R14.2 VT5.3(C)
NetDA2_3: DA2.3(RT/SYNC) R16.2
NetDA2_11: DA2.11(DEMB) R20.1
NetDA2_12: DA2.12(CS) R21.2 VT6.1 VT6.2 VT6.3
NetDA2_15: DA2.15(LO) VT6.4
NetDA2_19: DA2.19(HO) VT4.4
NetR3_1: R13.1 VT5.1(B) ; port dcdc_jetson_control

### Notes on the sheet
- (near VT4) Possible mosfets (all availible at chipdip.ru in less than 1 week):
- (near VT4) CSD19538Q3A (be careful, R_DS(on) is too high (58 mOhm) )
- (near VT4) SIR426DP-T1-GE3 (used)
- (near VT4) ISC0804NLSATMA1
- (near VT5) if 2.5v < control < 10v, dcdc is OFF
- (near VT5) if control < 0.8v or folating, dcdc is ON
- The values of C1, C2, R3 are selected as an example
- you need to test the Error Amplifier Compensation and select the values of these elements
- Перв. примен.
- Справ. №
- Подп. и дата
- Инв. № дубл.
- Взам. инв. №
- Инв. № подл.
- Изм.
- Лист
- № докум.
- Подп.
- Дата
- Копировал
- Формат А3
- (in symbol LM5116MH) DC-DC buck regulator

### Library data of the parts
C16-C19 = Capacitor_2,2u_10_50V_X7R_1206C: as C1 on sheet DCDC_Jetson; Part Number: Capacitor_2,2u_10_50V_X7R_1206C
C20-C23 = Capacitor_22u_10_25V_X7R_1210C: as C5 on sheet DCDC_Jetson; Part Number: Capacitor_22u_10_25V_X7R_1210C
C24 = Capacitor_0,1u_10_50V_X7R_0603C: as C9 on sheet DCDC_Jetson; Part Number: Capacitor_0,1u_10_50V_X7R_0603C
C25 C28 = Capacitor_1u_10_50V_X7R_0603C: as C10 on sheet DCDC_Jetson; Part Number: Capacitor_1u_10_50V_X7R_0603C
C26 = Capacitor_0,75n_10_50V_X7R_0603C: as C11 on sheet DCDC_Jetson; Part Number: Capacitor_0,75n_10_50V_X7R_0603C
C27 = Capacitor_10n_10_50V_X7R_0603C: as C12 on sheet DCDC_Jetson; Part Number: Capacitor_10n_10_50V_X7R_0603C
C29 = Capacitor_0,01n_10_50V_X7R_0603C: as C14 on sheet DCDC_Jetson; Part Number: Capacitor_0,01n_10_50V_X7R_0603C
C30 = Capacitor_0,15n_10_50V_X7R_0603C: as C15 on sheet DCDC_Jetson; Part Number: Capacitor_0,15n_10_50V_X7R_0603C
DA2 = LM5116MH: as DA1 on sheet DCDC_Jetson; Part Number: LM5116MH
L2 = CDSPRH127-150M: as L1 on sheet DCDC_Jetson; Part Number: CDSPRH127-150M
R12 = Resistor_33k_1_0603: Резистор номиналом 33 кОм и точностью 1%; Power: *; Part Number: Resistor_33k_1_0603; Tolerance: 1%
R13 = res_0603_N/A: as R3 on sheet DCDC_Jetson; Power: *; Value: N/A; Part Number: res_0603_N/A
R14 = Resistor_2.7k_1_0603: as R4 on sheet DCDC_Jetson; Power: *; Part Number: Resistor_2.7k_1_0603; Tolerance: 1%
R15 = Resistor_10.7k_1_0603: as R5 on sheet DCDC_Jetson; Power: *; Part Number: Resistor_10.7k_1_0603; Tolerance: 1%
R16 = Resistor_12.4k_1_0603: as R6 on sheet DCDC_Jetson; Power: *; Part Number: Resistor_12.4k_1_0603; Tolerance: 1%
R17 = Resistor_470k_1_0603: as R7 on sheet DCDC_Jetson; Power: *; Part Number: Resistor_470k_1_0603; Tolerance: 1%
R18 = Resistor_1.21k_1_0603: as R8 on sheet DCDC_Jetson; Power: *; Part Number: Resistor_1.21k_1_0603; Tolerance: 1%
R19 = Resistor_180k_1_0603: as R9 on sheet DCDC_Jetson; Power: *; Part Number: Resistor_180k_1_0603; Tolerance: 1%
R20 = Resistor_10k_1_0603: Резистор номиналом 10 кОм и точностью 1%; Power: *; Part Number: Resistor_10k_1_0603; Tolerance: 1%
R21 = RL1210FR-070R01L: as R11 on sheet DCDC_Jetson; Power: *; Part Number: RL1210FR-070R01L; Tolerance: 1%
VD2 = ES1D-E3/61T: as VD1 on sheet DCDC_Jetson; Part Number: ES1D-E3/61T
VT4 VT6 = SIR426DP-T1-GE3: as VT1 on sheet DCDC_Jetson; Part Number: SIR426DP-T1-GE3; Напряжение С-И/К-Э: 40 В
VT5 = PDTC114ET: as VT2 on sheet DCDC_Jetson; Part Number: PDTC114ET; Напряжение С-И/К-Э: 50 В

## Nets that join several sheets
+5В: Sheet1 (DD1.2 DD1.4 DD2.8), Connectors (5 pins), DCDC_RPI (7 pins)
+V_BAT: DCDC_Jetson (13 pins), Connectors (XP2.29 XP2.33), DCDC_RPI (13 pins)
GND: Sheet1 (9 pins), DCDC_Jetson (25 pins), Connectors (16 pins), DCDC_RPI (23 pins)
DCDC_EN: Sheet1 (DD1.35), Connectors (XP1.A15)
NetR3_1: DCDC_Jetson (R3.1 VT2.1), DCDC_RPI (R13.1 VT5.1)
RS485_N: Sheet1 (DD2.6 R1.1), Connectors (XP1.B16)
RS485_P: Sheet1 (DD2.7 R1.2), Connectors (XP1.B15)
UART0_RX: Sheet1 (DD1.10), Connectors (XP2.13)
UART0_TX: Sheet1 (DD1.8), Connectors (XP2.11)
UART2_RX: Sheet1 (DD1.28), Connectors (XP1.B11)
UART2_TX: Sheet1 (DD1.27), Connectors (XP1.B12)
UART4_RX: Sheet1 (DD1.21), Connectors (XP4.4)
UART4_TX: Sheet1 (DD1.24), Connectors (XP4.2)
UART5_RX: Sheet1 (DD1.33), Connectors (XP1.B13)
UART5_TX: Sheet1 (DD1.32), Connectors (XP1.B14)

## Assembly variants
01: all parts fitted